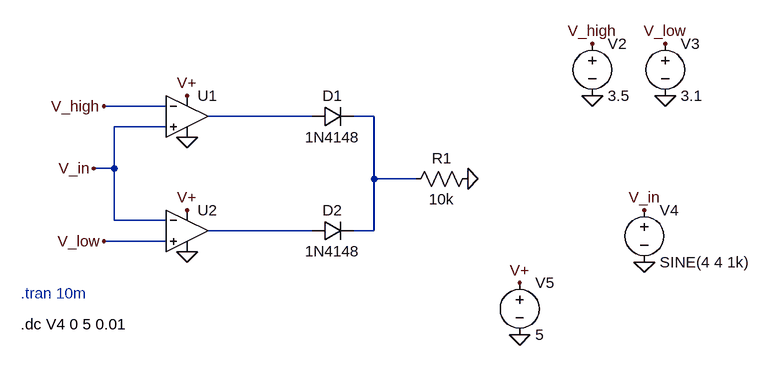
[diagram p0: schematic Window_Comparator.asc]
Window_Comparator.asc, the LTspice schematic file:
Version 4.1
SHEET 1 992 680
WIRE 80 96 -16 96
WIRE 304 112 144 112
WIRE 400 112 368 112
WIRE 80 128 0 128
WIRE 0 192 0 128
WIRE 0 192 -32 192
WIRE 400 208 400 112
WIRE 464 208 400 208
WIRE 0 272 0 192
WIRE 80 272 0 272
WIRE 304 288 144 288
WIRE 400 288 400 208
WIRE 400 288 368 288
WIRE 80 304 -16 304
FLAG -32 192 V_in
FLAG 736 80 0
FLAG 848 80 0
FLAG 816 336 0
FLAG 736 0 V_high
FLAG 848 0 V_low
FLAG 816 256 V_in
FLAG 624 448 0
FLAG 624 368 V+
FLAG 112 256 V+
FLAG 112 80 V+
FLAG 112 144 0
FLAG 112 320 0
FLAG -16 304 V_low
FLAG -16 96 V_high
FLAG 544 208 0
SYMBOL diode 304 128 R270
WINDOW 0 32 32 VTop 2
WINDOW 3 0 32 VBottom 2
SYMATTR InstName D1
SYMATTR Value 1N4148
SYMBOL diode 304 304 R270
WINDOW 0 32 32 VTop 2
WINDOW 3 0 32 VBottom 2
SYMATTR InstName D2
SYMATTR Value 1N4148
SYMBOL voltage 736 -16 R0
WINDOW 123 0 0 Left 0
WINDOW 39 0 0 Left 0
SYMATTR InstName V2
SYMATTR Value 3.5
SYMBOL voltage 848 -16 R0
WINDOW 123 0 0 Left 0
WINDOW 39 0 0 Left 0
SYMATTR InstName V3
SYMATTR Value 3.1
SYMBOL voltage 816 240 R0
WINDOW 123 0 0 Left 0
WINDOW 39 0 0 Left 0
SYMATTR InstName V4
SYMATTR Value SINE(4 4 1k)
SYMBOL voltage 624 352 R0
WINDOW 123 0 0 Left 0
WINDOW 39 0 0 Left 0
SYMATTR InstName V5
SYMATTR Value 5
SYMBOL res 560 192 R90
WINDOW 0 0 56 VBottom 2
WINDOW 3 32 56 VTop 2
SYMATTR InstName R1
SYMATTR Value 10k
SYMBOL OpAmps\\UniversalOpAmp2 112 112 R0
SYMATTR InstName U1
SYMBOL OpAmps\\UniversalOpAmp2 112 288 R0
SYMATTR InstName U2
TEXT -144 384 Left 2 ;.tran 10m
TEXT -144 432 Left 2 !.dc V4 0 5 0.01

The netlist it stands for:
* Window_Comparator.asc
D1 N001 N002 1N4148
D2 N003 N002 1N4148
V2 V_high 0 3.5
V3 V_low 0 3.1
V4 V_in 0 SINE(4 4 1k)
V5 V+ 0 5
R1 0 N002 10k
X§U1 V_in V_high V+ 0 N001 level2 Avol=1Meg GBW=10Meg Slew=10Meg Ilimit=25m Rail=0 Vos=0 En=0 Enk=0 In=0 Ink=0 Rin=500Meg  ; pins In+ In- V+ V- OUT
X§U2 V_low V_in V+ 0 N003 level2 Avol=1Meg GBW=10Meg Slew=10Meg Ilimit=25m Rail=0 Vos=0 En=0 Enk=0 In=0 Ink=0 Rin=500Meg  ; pins In+ In- V+ V- OUT
.model D D
.lib standard.dio
* .tran 10m
.dc V4 0 5 0.01
.lib UniversalOpAmp2.lib
.backanno
.end